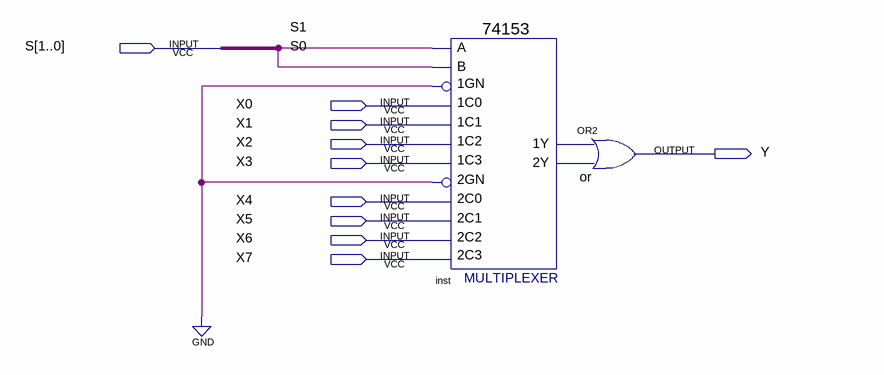
[diagram p0: schematic sheet]
// Quartus schematic TreinoMux.bdf as structural Verilog: 2 symbols, 10 pins
module TreinoMux (
  input  [1:0] S,
  input  X0,
  input  X1,
  input  X2,
  input  X3,
  input  X4,
  input  X5,
  input  X6,
  input  X7,
  output Y
);

  wire inst_1y, inst_2y;

  \74153  inst (
    .\1C1 (X1), .\1GN (1'b0), .\1C0 (X0), .\2C0 (X4), .\2GN (1'b0), .\2C2 (X6), .\1C2 (X2), .\1C3 (X3),
    .B(S[0]), .A(S[1]), .\2C1 (X5), .\2C3 (X7), .\1Y (inst_1y), .\2Y (inst_2y));
  or \or  (Y, inst_1y, inst_2y);
endmodule
